# EAGLE design 2AND_2 (EAGLE 6.5.0)
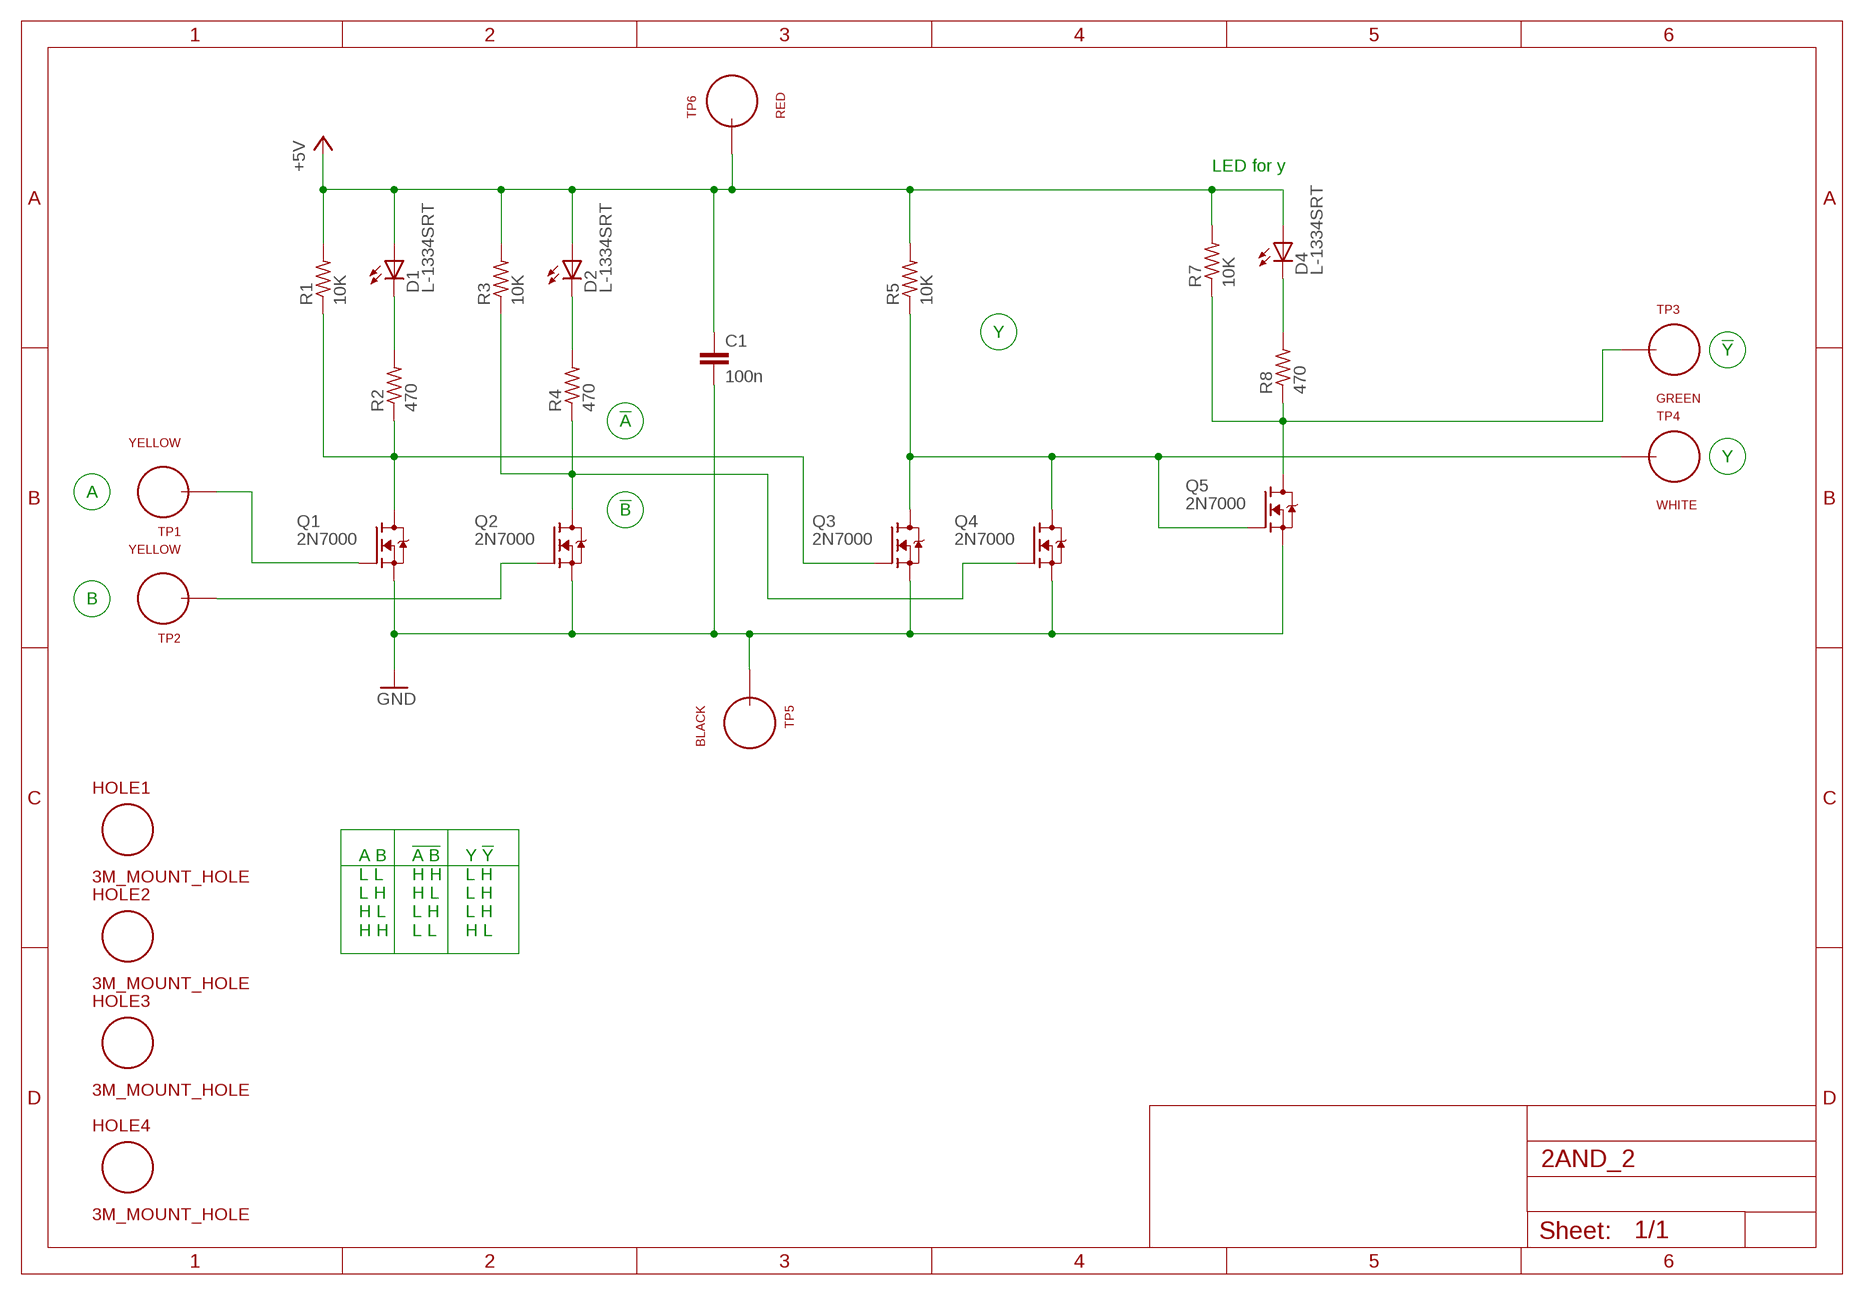
[diagram p0: schematic, sheet 1]

## Parts
C1  100n  C_P2INCH  [CAP_P2INCH]
D1  L-1334SRT  [LED3MM]
D2  L-1334SRT  [LED3MM]
D4  L-1334SRT  [LED3MM]
HOLE1  3M_MOUNT_HOLE  [3M_HOLE]
HOLE2  3M_MOUNT_HOLE  [3M_HOLE]
HOLE3  3M_MOUNT_HOLE  [3M_HOLE]
HOLE4  3M_MOUNT_HOLE  [3M_HOLE]
Q1  2N7000  [TO92-DGS]
Q2  2N7000  [TO92-DGS]
Q3  2N7000  [TO92-DGS]
Q4  2N7000  [TO92-DGS]
Q5  2N7000  [TO92-DGS]
R1  10K  R_P2INCH  [R_P2INCH]
R2  470  R_P2INCH  [R_P2INCH]
R3  10K  R_P2INCH  [R_P2INCH]
R4  470  R_P2INCH  [R_P2INCH]
R5  10K  R_P2INCH  [R_P2INCH]
R7  10K  R_P2INCH  [R_P2INCH]
R8  470  R_P2INCH  [R_P2INCH]
TP1  YELLOW  TEST_LOOP  [TEST_LOOP]
TP2  YELLOW  TEST_LOOP  [TEST_LOOP]
TP3  GREEN  TEST_LOOP  [TEST_LOOP]
TP4  WHITE  TEST_LOOP  [TEST_LOOP]
TP5  BLACK  TEST_LOOP  [TEST_LOOP]
TP6  RED  TEST_LOOP  [TEST_LOOP]

## Nets
+5V: C1.1 D1.A D2.A D4.A R1.2 R3.2 R5.2 R7.2 TP6.P$1
GND: C1.2 Q1.S Q2.S Q3.S Q4.S Q5.S TP5.P$1
N$1: Q3.D Q4.D Q5.G R5.1 TP4.P$1
N$3: D4.K(C) R8.2
N$4: Q5.D R7.1 R8.1 TP3.P$1
N$6: D2.K(C) R4.2
N$7: Q2.D Q4.G R3.1 R4.1
N$8: D1.K(C) R2.2
N$9: Q1.D Q3.G R1.1 R2.1
N$11: Q1.G TP1.P$1
N$12: Q2.G TP2.P$1

## Notes on the sheet
- LED for y
- Y
- !Y
- !A
- Y
- A
- !B
- B
- A B
  L L
  L H
  H L
  H H
- !A B
  H H
  H L
  L H
  L L
- Y !Y
  L H
  L H
  L H
  H L

## Library data of the parts
C1 = MyLib:C_P2INCH
D1 D2 D4 = MyLib:L-1334SRT
HOLE1-HOLE4 = MyLib:3M_MOUNT_HOLE
Q1-Q5 = MyLib:2N7000
R1-R5 R7 R8 = MyLib:R_P2INCH
TP1-TP6 = MyLib:TEST_LOOP

## Board
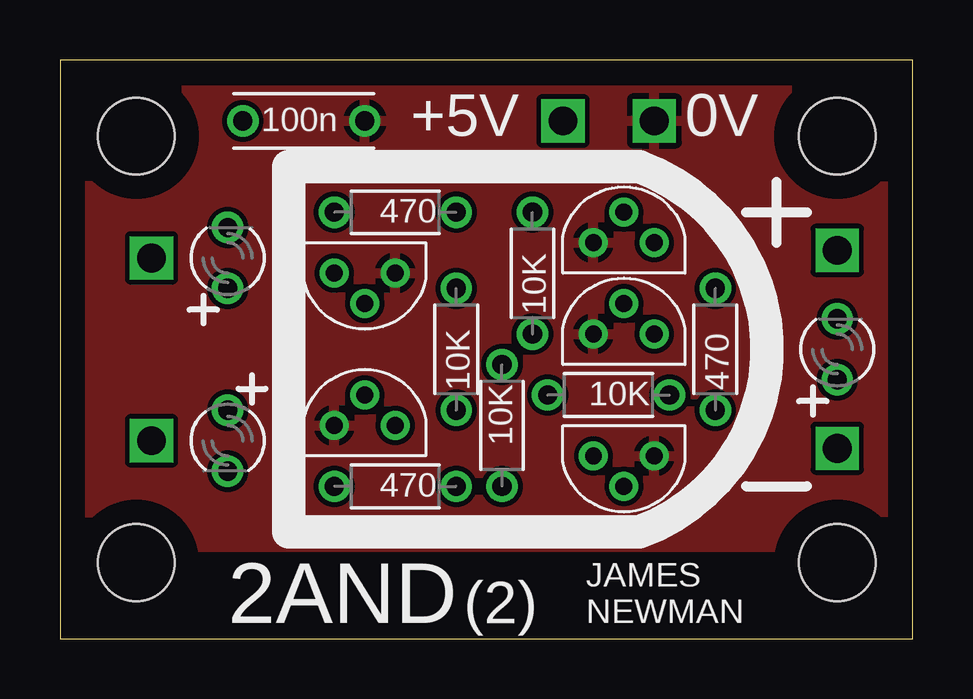
[diagram p1: board, top side]
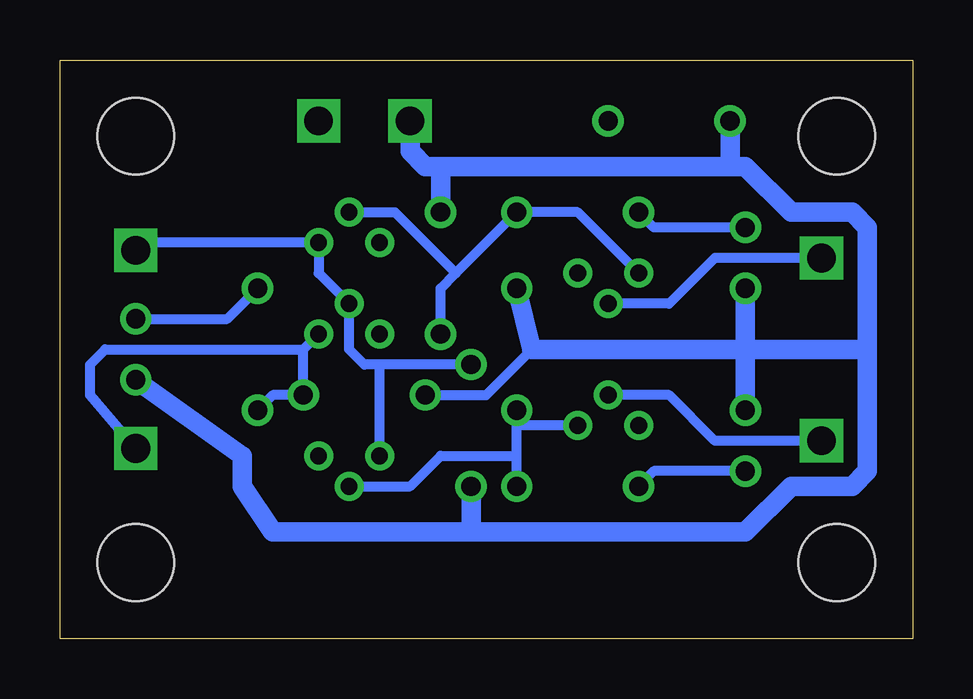
[diagram p2: board, bottom side, seen from below]

Size 35.54 x 24.13 mm. Coordinates in mm from the lower left corner, seen from the top.
Outline: 0,0 35.54,0 35.54,24.13 0,24.13 0,0
Copper layers (1*16): Top 0.035mm / dielectric 1.5mm / Bottom 0.035mm
Design rules "processor_rules *": minimum track width 10mil, minimum drill 0.0236mm, track to track 8mil, track to pad 8mil, pad to pad 8mil, via to via 8mil, smd to smd 8mil, copper to edge 40mil, drill to drill 8mil, minimum pad ring 10mil, minimum via ring 8mil, stop-mask expansion 4mil, vias tented up to drill 0.7mm, thermal gap 10mil

### Footprints (pad centres in the part's own frame; a part is rotated, then mirrored left to right if it is on the bottom)
CAP_P2INCH = drill 0.8: 1 -2.54,0; 2 2.54,0
LED3MM = drill 0.8: A -1.27,0; K 1.27,0
3M_HOLE = hole 3.2: 0,0
TO92-DGS = drill 0.7: D 0,1.27; G -1.27,0; S 0,-1.27
R_P2INCH = drill 0.8: 1 -2.54,0; 2 2.54,0
TEST_LOOP = drill 1.2 square: P$1 0,0

### Placement (x,y rotation side)
C1  10.16,21.59 0 top
D1  6.99,15.88 90 top
D2  6.99,8.26 270 top
D4  32.38,12.06 90 top
HOLE1  3.17,3.17 0 top
HOLE2  3.17,20.95 0 top
HOLE3  32.38,3.17 0 top
HOLE4  32.38,20.95 0 top
Q1  12.7,15.24 90 top
Q2  12.7,8.89 270 top
Q3  23.5,16.51 270 top
Q4  23.5,7.62 90 top
Q5  23.5,12.7 270 top
R1  19.68,15.24 90 top
R2  13.97,17.78 180 top
R3  16.51,12.06 90 top
R4  13.97,6.35 180 top
R5  18.41,8.89 270 top
R7  22.86,10.16 180 top
R8  27.3,12.06 90 top
TP1  3.81,15.88 0 top
TP2  3.81,8.26 0 top
TP3  32.38,7.94 0 top
TP4  32.38,16.19 0 top
TP5  24.77,21.59 0 top
TP6  20.95,21.59 0 top

### Tracks (layer width: path | path; a pad name or v marks a point on that pad's centre or on a via)
+5V
  Bottom 0.406: R7.2 17.78,10.16 15.88,12.06
  Bottom 0.813: 18.41,4.45 26.67,4.45 27.94,6.35 27.94,7.62 D4.A | 18.41,4.45 6.99,4.45 5.08,6.35 2.54,6.35 1.91,6.99 1.91,12.06 | 1.91,12.06 1.91,17.14 2.54,17.78 5.08,17.78 6.99,19.68 7.62,19.68 | 6.99,12.06 D2.A | 6.99,12.06 1.91,12.06 | 6.99,12.06 15.88,12.06 R3.2 | R5.2 18.41,4.45 | 6.99,12.06 D1.A | 7.62,19.68 19.68,19.68 | 19.68,19.68 20.32,19.68 20.95,20.32 TP6.P$1 | R1.2 19.68,19.68 | C1.1 7.62,19.68
GND
  pour Top: 1.27,22.86 34.29,22.86 34.29,3.81 1.27,3.81
N$1
  Bottom 0.406: R5.1 22.23,11.43 | 22.23,11.43 22.86,11.43 23.5,12.06 Q5.G 24.77,15.24 Q3.D 31.75,16.51 TP4.P$1 | Q4.D 22.23,11.43
N$3
  Bottom 0.406: D4.K 28.57,13.34 R8.2
N$4
  Bottom 0.406: 25.4,12.06 R7.1 26.67,10.16 R8.1 | 25.4,12.06 Q5.D | TP3.P$1 34.29,10.16 34.29,11.43 33.66,12.06 25.4,12.06
N$6
  Bottom 0.406: D2.K 10.79,6.99 R4.2
N$7
  Bottom 0.406: R4.1 16.51,7.62 | 16.51,7.62 16.51,8.89 | 16.51,8.89 R3.1 | Q2.D 16.51,8.89 | Q4.G 20.95,6.35 19.68,7.62 16.51,7.62
N$8
  Bottom 0.406: D1.K 10.79,17.14 R2.2
N$9
  Bottom 0.406: Q1.D 13.97,17.78 R2.1 19.05,15.24 | R1.1 19.68,14.61 19.05,15.24 | Q3.G 21.59,17.78 19.05,15.24
N$11
  Bottom 0.406: TP1.P$1 8.26,15.88 10.16,13.97 Q1.G
N$12
  Bottom 0.406: TP2.P$1 8.26,8.26 10.16,10.16 Q2.G

### Text on the board
tPlace: +5V | 0V | 2AND | (2) | JAMES / NEWMAN